# Altium project Noise Toaster.PrjPcb (part 3 of 3)

## Sheet VCF.SchDoc: Voltage Controlled Filter
size Letter; SheetNumber: 8; SheetTotal: 10
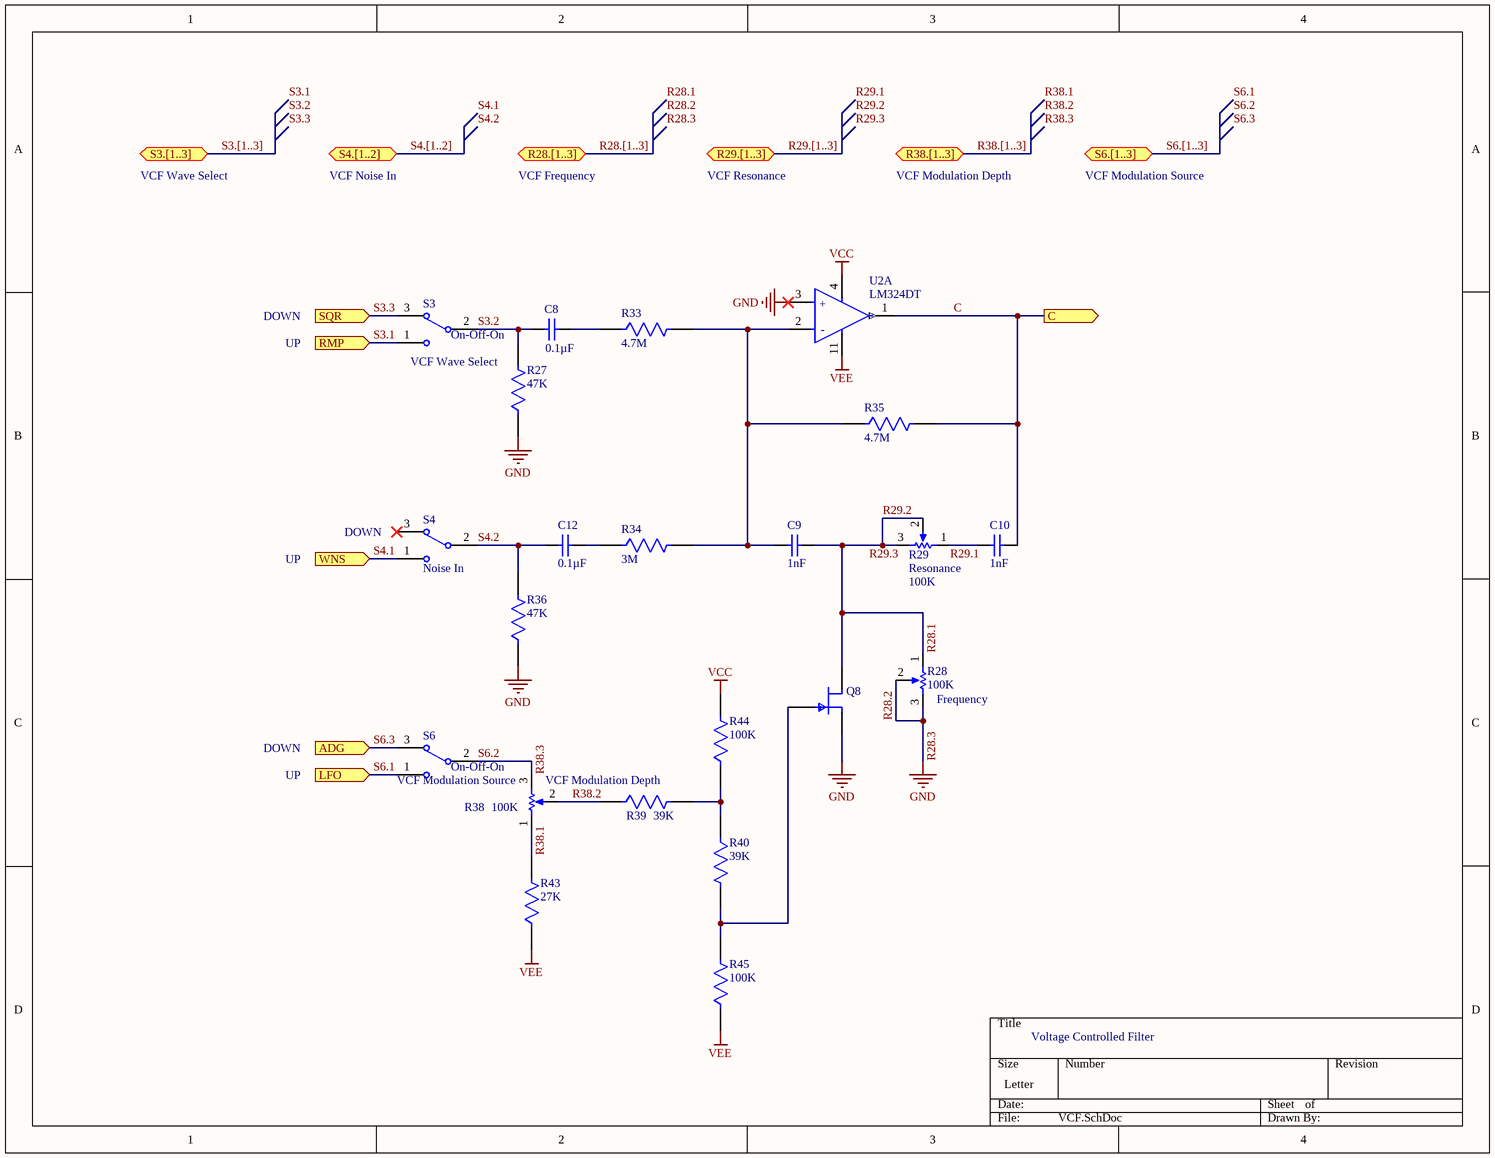
[diagram p7: VCF.SchDoc]

### Parts
C8  Capacitance: 0.1µF  [SAMS-C0603-2_M]  (hidden comment: CL10B104KB8NNNC)
C9  Capacitance: 1nF  [CAPC1608X90X35NL10T15]  (hidden comment: 885012206083‎)
C10  Capacitance: 1nF  [CAPC1608X90X35NL10T15]  (hidden comment: 885012206083‎)
C12  Capacitance: 0.1µF  [SAMS-C0603-2_M]  (hidden comment: CL10B104KB8NNNC)
Q8  MMBFJ113  [FP-318BM-IPC_C]  (value not drawn)
R27  Resistance: 47K  [FP-ESR03-IPC_B]  (hidden comment: ESR03EZPJ473)
R28  Frequency  value 100K  [VR5]  (graphical)
R29  Resonance  value 100K  [VR5]  (graphical)
R33  Resistance: 4.7M  [FP-ESR03-IPC_B]  (hidden comment: ESR03EZPJ475)
R34  Resistance: 3M  [FP-ESR03-IPC_B]  (hidden comment: ESR03EZPJ305)
R35  Resistance: 4.7M  [FP-ESR03-IPC_B]  (hidden comment: ESR03EZPJ475)
R36  Resistance: 47K  [FP-ESR03-IPC_B]  (hidden comment: ESR03EZPJ473)
R38  VCF Modulation Depth  value 100K  [VR5]  (graphical)
R39  Resistance: 39K  [FP-ESR03-IPC_B]  (hidden comment: ESR03EZPJ393)
R40  Resistance: 39K  [FP-ESR03-IPC_B]  (hidden comment: ESR03EZPJ393)
R43  Resistance: 27K  [FP-ESR03-IPC_B]  (hidden comment: ESR03EZPJ273)
R44  Resistance: 100K  [FP-ESR03-IPC_B]  (hidden comment: ESR03EZPJ104)
R45  Resistance: 100K  [FP-ESR03-IPC_B]  (hidden comment: ESR03EZPJ104)
S3  VCF Wave Select  Switch Function: On-Off-On  [HDR1X3]  (graphical)
S4  Noise In  [HDR1X3]
S6  VCF Modulation Source  Switch Function: On-Off-On  [HDR1X3]  (graphical)
U2  LM324DT  [FP-SO-14-MFG]  (part A of 4)

### Ports
ADG (in), C (out), LFO (in), R28.[1..3] (bidir), R29.[1..3] (bidir), R38.[1..3] (bidir), RMP (in), S3.[1..3] (bidir), S4.[1..2] (bidir), S6.[1..3] (bidir), SQR (in), WNS (in)

### Nets
GND: Q8.2(S) R27.1 R28.2(TAP) R28.3(BOT) R36.1 U2.3(Non-Inverting_Input_1)  [also labelled R28.2, R28.3]
VCC: R44.2 U2.4(VCC+)
VEE: R43.1 R45.1 U2.11(VCC-)
C: C10.2 R35.2 U2.1(Output_1) ; port C
R28.1: C9.2 Q8.1(D) R28.1(TOP) R29.2(TAP) R29.3(BOT)  [also labelled R29.2, R29.3]
R29.1: C10.1 R29.1(TOP)
R38.1: R38.1(TOP) R43.2
R38.2: R38.2(TAP) R39.1
R38.3: R38.3(BOT) S6.2  [also labelled S6.2]
S3.1: S3.1 ; port RMP  [project net RMP]
S3.2: C8.1 R27.2 S3.2
S3.3: S3.3 ; port SQR
S4.1: S4.1 ; port WNS
S4.2: C12.1 R36.2 S4.2
S6.1: S6.1 ; port LFO  [project net LFO]
S6.3: S6.3 ; port ADG  [project net ADG]
NetC8_2: C8.2 R33.1
NetC9_1: C9.1 R33.2 R34.2 R35.1 U2.2(Inverting_Input_1)
NetC12_2: C12.2 R34.1
NetQ8_3: Q8.3(G) R40.2 R45.2
NetR39_2: R39.2 R40.1 R44.1

Not connected (* = marked no-connect by the designer): S4 3*

### Buses and harness runs
bus R28.[1..3] = port R28.[1..3]
bus R29.[1..3] = port R29.[1..3]
bus R38.[1..3] = port R38.[1..3]
bus S3.[1..3] = port S3.[1..3]
bus S4.[1..2] = port S4.[1..2]
bus S6.[1..3] = port S6.[1..3]

### Notes on the sheet
- VCF Wave Select
- VCF Noise In
- VCF Frequency
- VCF Resonance
- VCF Modulation Depth
- VCF Modulation Source
- DOWN
- UP
- (near S4) DOWN
- Labels drawn without touching a wire or pin: R28.1, R28.2, R28.3, R29.1, R29.2, R29.3, R38.1, R38.2, R38.3, S3.1, S3.2, S3.3, S4.1, S4.2, S6.1, S6.2, S6.3
- (in symbol CMP-12131-000005-1, part A) +; -

### Library data of the parts
C8 C12 = CMP-2000-05332-1: Multi-layer Ceramic Capacitor, -55 to 125 degC, 2-Pin SMD (0603), RoHS, Tape and Reel; Manufacturer: Samsung Electro-Mechanics; Rated Voltage: 50V; Dielectric: X7R; Tolerance (%): ±10%; Case Size/Dimension: 0603; Datasheet URL: https://datasheet.ciiva.com/29198/456651-da-01-en-vs-kondensator-0605-29198839.pdf; Manufacturer URL: http://www.samsungsem.com/global/index.jsp; Datasheet Version: Nov-10
C9 C10 = CMP-2006-02891-1: Manufacturer: Wurth; Voltage Rating: 50V; Dielectric: X7R; Tolerance: 10%; Part Number: 885012206083‎; Supplier 1: RSComponents; Supplier Part Number 1: 8392938; Manufacturer Part Number: 885012206083; RoHS: Yes; Category: Ceramic Capacitors; Stock 1: 1; Pricing 1: 100=0.02300, 500=0.02000, 2000=0.01800, 4000=0.01600, 8000=0.00900 (USD); Mount: Surface Mount; Case/Package: 0603; Case Code (Metric): 1608; Case Code (Imperial): 0603; Min Operating Temperature: -55°C; Max Operating Temperature: 125°C; Packaging: Cut Tape; Voltage Rating (DC): 50V; Length: 0.063inch; Width: 0.031inch; Thickness: 0.037inch; REACH SVHC: Unknown; RoHS Compliant: Yes; ComponentLink1URL: http://www.farnell.com/datasheets/1958479.pdf?src-supplier=Farnell; ComponentLink1Description: http://www.farnell.com/datasheets/1958479.pdf?src-supplier=Farnell; ComponentLink2URL: http://www.farnell.com/datasheets/1958479.pdf?src-supplier=Element14; ComponentLink2Description: http://www.farnell.com/datasheets/1958479.pdf?src-supplier=Element14; ComponentLink3URL: https://katalog.we-online.de/pbs/datasheet/885012206083.pdf?src-supplier=Digi-Key; ComponentLink3Description: https://katalog.we-online.de/pbs/datasheet/885012206083.pdf?src-supplier=Digi-Key; ComponentLink4URL: http://www.farnell.com/datasheets/1958479.pdf?src-supplier=Newark; ComponentLink4Description: http://www.farnell.com/datasheets/1958479.pdf?src-supplier=Newark
Q8 = CMP-07172-000001-1: JFET N-CH 35V 350MW SOT23; Manufacturer: ON Semiconductor; Number Of N Channels: 1; Gate To Source Voltage: -35V; Drain To Source Resistance: 100Ω; Standoff Height: 0mm; Rthja Max: 357°C/W; Max Junction Temp: +150°C; Gate to Source Voltage (Vgs): -25V; Element Configuration: Single; Input Capacitance: 7pF; Drain to Source Voltage (Vdss): 25V; Continuous Drain Current (ID): 5mA; Current Rating: 10mA; Polarity: N-CHANNEL; Device Class L2: Transistors; Number Of Channels: 1; ComponentLink2Description: Datasheet; Device Class L3: JFETs; Device Class L1: Discrete Semiconductors; Lead Free: Yes; Power Dissipation: 350mW; Category: Trans; Mouser Description: JFET N-Channel Switch; ComponentLink2URL: https://www.onsemi.com/pub/Collateral/MMBFJ113-D.PDF; RoHS: TRUE; Footprint Url: https://www.onsemi.com/pub/Collateral/318BM.PDF; Height: 1.2mm; Package: 318BM; Temperature Range High: +150°C; Manufacturer Part Number: MMBFJ113; Temperature: -55°C to +150°C; Digikey Description: JFET N-CH 35V 350MW SOT23; Temperature Range Low: -55°C; Octopart: https://octopart.com/mmbfj113-on+semiconductor-84330253; Automotive: No; Ipc Land Pattern Name: SOT95P240X120-3; Supplier 1: Digi-Key; Supplier Part Number 1: MMBF5457CT-ND; Stock 1: 13304; Pricing 1: 1=0.50000, 10=0.39000, 25=0.37280, 100=0.23400, 500=0.21670, 1000=0.14736 (USD); Mount: Surface Mount; Case/Package: SOT-23; Number of Pins: 3; Weight: 0.03g; Contact Plating: Tin,Matte; Min Operating Temperature: -55°C; Max Operating Temperature: 150°C; Packaging: Tape and Reel; Package Quantity: 1; Max Power Dissipation: 350mW; Voltage Rating (DC): 25V; Series: MMBF5457; Length: 2.92mm; Width: 1.3mm; Radiation Hardening: No; RoHS Compliant: Yes; REACH SVHC: No SVHC; ComponentLink1URL: https://datasheet.ciiva.com/25625/0900766b810cdc04-25625787.pdf?src-supplier=RSComponents; ComponentLink1Description: https://datasheet.ciiva.com/25625/0900766b810cdc04-25625787.pdf?src-supplier=RSComponents; ComponentLink3URL: https://datasheet.ciiva.com/8120/mmbf5459-8120391.pdf?src-supplier=Avnet; ComponentLink3Description: https://datasheet.ciiva.com/8120/mmbf5459-8120391.pdf?src-supplier=Avnet; ComponentLink4URL: https://datasheet.ciiva.com/26026/mmbf5459-26026568.pdf?src-supplier=Avnet+Europe; ComponentLink4Description: https://datasheet.ciiva.com/26026/mmbf5459-26026568.pdf?src-supplier=Avnet+Europe; ComponentLink5URL: https://datasheet.ciiva.com/960/mmbf5457-960906.pdf?src-supplier=Digi-Key; ComponentLink5Description: https://datasheet.ciiva.com/960/mmbf5457-960906.pdf?src-supplier=Digi-Key; ComponentLink6URL: https://datasheet.ciiva.com/960/mmbf5457-960907.pdf?src-supplier=Digi-Key; ComponentLink6Description: https://datasheet.ciiva.com/960/mmbf5457-960907.pdf?src-supplier=Digi-Key; ComponentLink7URL: https://datasheet.ciiva.com/46445/46943-46445739.pdf?src-supplier=Element14; ComponentLink7Description: https://datasheet.ciiva.com/46445/46943-46445739.pdf?src-supplier=Element14; ComponentLink8URL: https://datasheet.ciiva.com/960/mmbf5457-960908.pdf?src-supplier=Digi-Key; ComponentLink8Description: https://datasheet.ciiva.com/960/mmbf5457-960908.pdf?src-supplier=Digi-Key; ComponentLink9URL: https://datasheet.ciiva.com/3304/mmbf5459-3304349.pdf?src-supplier=Avnet; ComponentLink9Description: https://datasheet.ciiva.com/3304/mmbf5459-3304349.pdf?src-supplier=Avnet
R27 R36 = CMP-08839-028279-1: 47kΩ ±5% 0.25W 0603 Anti-Surge Chip Resistor AEC-Q200; Max Power Dissipation: 250mW; Temperature Coefficient: 200ppm/°C; Series: ESR; Number of Terminations: 2; Min Operating Temperature: -55°C; Features: Automotive AEC-Q200; Width: 0.031inch; Case Code (Imperial): 0603; Case/Package: 0603; Packaging: Tape and Reel; Resistor Type: Thick Film; Length: 0.063inch; Tolerance: 5%; Package Quantity: 1; Max Operating Temperature: 155°C; Height: 0.022inch; Case Code (Metric): 1608; RoHS Compliant: Yes
R28 R29 R38 = RPot: Potentiometer; Sim Note: Enter the Resistance value and the set point into parameter fields.; Set Position: 0.5; Published: 8-Jun-2000; LatestRevisionDate: 17-Jul-2002; LatestRevisionNote: Re-released for DXP Platform.; PackageReference: VR5; Publisher: Altium Limited; PackageDescription: Variable Resistor, Thru-Hole; 3 Leads
R33 R35 = CMP-08839-028926-1: 4.7MΩ ±5% 0.25W 0603 Anti-Surge Chip Resistor AEC-Q200; Temperature Coefficient: 200ppm/°C; Max Power Dissipation: 250mW; Series: ESR; Package Quantity: 5000; Packaging: Cut Tape; Min Operating Temperature: -55°C; RoHS Compliant: Yes; Number of Terminations: 2; Resistor Type: Thick Film; Tolerance: 5%; Length: 0.063inch; Height: 0.022inch; Width: 0.031inch; Case Code (Metric): 1608; Case/Package: 0603; Max Operating Temperature: 155°C; Features: Automotive AEC-Q200; Case Code (Imperial): 0603
R34 = CMP-08839-028673-1: 3MΩ ±5% 0.25W 0603 Anti-Surge Chip Resistor AEC-Q200; Max Power Dissipation: 250mW; Temperature Coefficient: 200ppm/°C; Case Code (Metric): 1608; Resistor Type: Thick Film; Tolerance: 5%; Length: 0.063inch; Case Code (Imperial): 0603; Max Operating Temperature: 155°C; Packaging: Tape and Reel; Package Quantity: 5000; Case/Package: 0603; Series: ESR; Width: 0.031inch; Min Operating Temperature: -55°C; Height: 0.022inch; RoHS Compliant: Yes; Features: Automotive AEC-Q200; Number of Terminations: 2
R39 R40 = CMP-08839-004997-1: 39kΩ ±5% 0.25W 0603 Anti-Surge Chip Resistor AEC-Q200; Max Power Dissipation: 250mW; Temperature Coefficient: 200ppm/°C; Case Code (Imperial): 0603; Min Operating Temperature: -55°C; Features: Automotive AEC-Q200; Length: 0.063inch; Case/Package: 0603; Max Operating Temperature: 155°C; Resistor Type: Thick Film; Package Quantity: 5000; Case Code (Metric): 1608; Number of Terminations: 2; Packaging: Cut Tape; Tolerance: 5%; Width: 0.031inch; Series: ESR; RoHS Compliant: Yes; Height: 0.022inch
R43 = CMP-08839-028661-1: 27kΩ ±5% 0.25W 0603 Anti-Surge Chip Resistor AEC-Q200; Temperature Coefficient: 200ppm/°C; Max Power Dissipation: 250mW; Max Operating Temperature: 155°C; Case Code (Metric): 1608; Case Code (Imperial): 0603; Width: 0.031inch; Packaging: Cut Tape; Series: ESR; Number of Terminations: 2; RoHS Compliant: Yes; Case/Package: 0603; Features: Automotive AEC-Q200; Tolerance: 5%; Length: 0.063inch; Height: 0.022inch; Min Operating Temperature: -55°C; Resistor Type: Thick Film; Package Quantity: 5000
R44 R45 = CMP-08839-029521-1: 100kΩ ±5% 0.25W 0603 Anti-Surge Chip Resistor AEC-Q200; Power Rating: 200mW; Max Power Dissipation: 250mW; Temperature Coefficient: 200ppm/°C; Length: 0.063inch; Case Code (Imperial): 0603; Case/Package: 0603; Resistor Type: Thick Film; Features: Automotive AEC-Q200; Package Quantity: 1; Width: 0.031inch; Packaging: Cut Tape; Min Operating Temperature: -55°C; Series: ESR; RoHS Compliant: Yes; Size Code: 0603; Tolerance: 5%; Height: 0.022inch; Max Operating Temperature: 155°C; Lead Free: Lead Free; Case Code (Metric): 1608; Number of Terminations: 2
S3 S6 = SW-SPDT: Switch Toggle ON OFF ON SPDT Round Lever Solder Lug 5A 250VAC 28VDC Panel Mount with Threads; Manufacturer: E-Switch; Manufacturer Part Number: 100SP3T1B1M1QEH; Actuator Material: Brass,Chrome; Actuator Color: Chrome; Voltage Rating (AC): 120V; Voltage Rating (DC): 28V; Illumination Type: Non-Illuminated,Illuminated; Electrical Life: 40000Cycles; Actuator Type: Standard Round; Contact Resistance: 100mR; Max Voltage Rating (AC): 250V; Actuator Length: 10.41mm; Published: 24-Mar-1999; LatestRevisionDate: 17-Dec-2003; LatestRevisionNote: Schematic revised, PCB Footprint replaced.; DatasheetVersion: 05-Dec-2000; PackageReference: TL36WW15050; Publisher: Altium Limited; PackageDescription: Switch; 4 Leads; ComponentLink1Description: Manufacturer Link; ComponentLink1URL: http://www.apem.com; Supplier 1: Newark; Supplier Part Number 1: 16N0109; RoHS: Yes; Category: Toggle Switches; Stock 1: 100; Pricing 1: 1=3.40000, 10=3.05000, 25=2.88000, 50=2.75000, 100=2.61000, 250=2.50000 (USD); Mount: Panel; Contact Material: Copper Alloy,Silver; Contact Plating: Silver; Housing Material: Stainless Steel; Min Operating Temperature: -30°C; Max Operating Temperature: 85°C; Throw Configuration: SPDT; Package Quantity: 1; Packaging: Bulk; Termination: Solder; Orientation: Straight; Series: 100; Current Rating: 5A; Max Voltage Rating (DC): 28V; Lead Free: Lead Free; RoHS Compliant: Yes; ComponentLink2URL: https://datasheet.ciiva.com/2905/1012730000-jpg-2905501.pdf?src-supplier=Digi-Key; ComponentLink2Description: https://datasheet.ciiva.com/2905/1012730000-jpg-2905501.pdf?src-supplier=Digi-Key; ComponentLink3URL: https://datasheet.ciiva.com/24480/st113001-24480688.pdf?src-supplier=Onlinecomponents.com; ComponentLink3Description: https://datasheet.ciiva.com/24480/st113001-24480688.pdf?src-supplier=Onlinecomponents.com; ComponentLink4URL: https://datasheet.ciiva.com/16338/100-16338027.pdf?src-supplier=Future+Electronics; ComponentLink4Description: https://datasheet.ciiva.com/16338/100-16338027.pdf?src-supplier=Future+Electronics
S4 = SW-SPDT: Switch Toggle ON None ON SPDT Round Lever Solder Lug 5A 250VAC 28VDC Panel Mount with Threads; Manufacturer: E-Switch; Manufacturer Part Number: 100SP1T1B1M1QEH; Actuator Material: Brass,Chrome; Actuator Color: Chrome; Voltage Rating (AC): 120V; Voltage Rating (DC): 28V; Max Voltage Rating (AC): 250V; Illumination Type: Illuminated,Non-Illuminated; Switch Function: On-On; Actuator Type: Standard Round; Contact Resistance: 100mR; Electrical Life: 40000Cycles; Actuator Length: 10.41mm; Supplier 1: Newark; Supplier Part Number 1: 15N9971; RoHS: Yes; Category: Toggle Switches; Stock 1: 978; Pricing 1: 1=3.08000, 10=2.76000, 25=2.61000, 50=2.49000, 100=2.37000 (USD); Mount: Panel; Contact Material: Copper Alloy,Silver; Contact Plating: Silver; Housing Material: Stainless Steel; Min Operating Temperature: -30°C; Max Operating Temperature: 85°C; Throw Configuration: SPDT; Current Rating: 5A; Package Quantity: 1; Packaging: Bulk; Max Voltage Rating (DC): 28V; Termination: Solder; Orientation: Straight; Series: 100; REACH SVHC: No SVHC; Lead Free: Lead Free; RoHS Compliant: Yes; ComponentLink1URL: https://datasheet.ciiva.com/2904/st110007c-2904798.pdf?src-supplier=Digi-Key; ComponentLink1Description: https://datasheet.ciiva.com/2904/st110007c-2904798.pdf?src-supplier=Digi-Key; ComponentLink2URL: https://datasheet.ciiva.com/16154/xt0157p-16154561.pdf?src-supplier=Onlinecomponents.com; ComponentLink2Description: https://datasheet.ciiva.com/16154/xt0157p-16154561.pdf?src-supplier=Onlinecomponents.com; ComponentLink3URL: https://datasheet.ciiva.com/16347/100-16347391.pdf?src-supplier=Future+Electronics; ComponentLink3Description: https://datasheet.ciiva.com/16347/100-16347391.pdf?src-supplier=Future+Electronics
U2 = CMP-12131-000005-1: IC OPAMP GP 4 CIRCUIT 14SO; Manufacturer: STMicroelectronics; Voltage Gain: 100dB; Standoff Height: 0.1mm; Bandwidth: 1.3MHz; Max Junction Temp: +150°C; Min Supply Voltage: 3V; Max Dual Supply Voltage: 15V; Min Dual Supply Voltage: 1.5V; Number Of Channels: 4; Nominal Supply Current: 0.7-1.5mA; Output Current Per Channel: 20-50mA; Max Supply Voltage: 30V; Input Offset Voltage: 2mV; Input Bias Current: 0.02uA; Device Class L1: Integrated Circuits (ICs); Device Class L3: Amplifiers - Op Amps; Temperature Range Low: 0°C; Package: SO-14; Temperature Range High: +70°C; Digikey Description: IC OPAMP GP 4 CIRCUIT 14SO; Device Class L2: Linear ICs; Footprint Url: https://www.st.com/content/ccc/resource/technical/document/datasheet/group3/10/8a/e6/12/f8/e8/49/ce/DM00366438/files/DM00366438.pdf/jcr:content/translations/en.DM00366438.pdf; Octopart: https://octopart.com/lm324dt-stmicroelectronics-39579146; ComponentLink2URL: https://www.st.com/content/ccc/resource/technical/document/datasheet/bd/fc/46/43/26/8f/40/7f/CD00001046.pdf/files/CD00001046.pdf/jcr:content/translations/en.CD00001046.pdf; ComponentLink2Description: Datasheet; Lead Free: Yes; Temperature: 0°C to +70°C; RoHS: TRUE; Gain Bandwidth: 1.3MHz; Manufacturer Part Number: LM324DT; Automotive: No; Category: IC; Height: 1.75mm; Mouser Description: LM324 Series 32 V 1.3 MHz Low Power Quad Operational Amplifier - SOIC-14

## Sheet VCA.SchDoc: Voltage Controlled Amplifier
size Letter; SheetNumber: 7; SheetTotal: 10
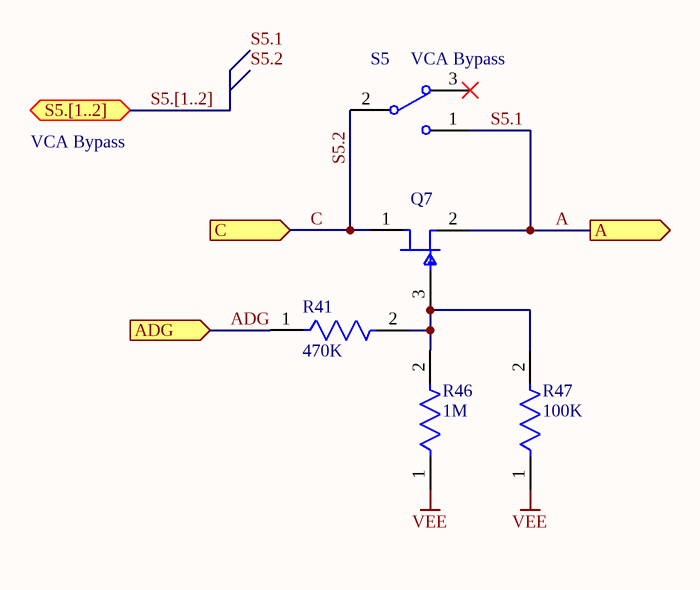
[diagram p8: VCA.SchDoc]

### Parts
Q7  MMBFJ113  [FP-318BM-IPC_C]  (value not drawn)
R41  Resistance: 470K  [FP-ESR03-IPC_B]  (hidden comment: ESR03EZPJ474)
R46  Resistance: 1M  [FP-ESR03-IPC_B]  (hidden comment: ESR03EZPJ105)
R47  Resistance: 100K  [FP-ESR03-IPC_B]  (hidden comment: ESR03EZPJ104)
S5  VCA Bypass  [HDR1X3]

### Ports
A (out), ADG (in), C (in), S5.[1..2] (bidir)

### Nets
VEE: R46.1 R47.1
A: Q7.2(S) S5.1 ; port A  [also labelled S5.1]
ADG: R41.1 ; port ADG
C: Q7.1(D) S5.2 ; port C  [also labelled S5.2]
NetQ7_3: Q7.3(G) R41.2 R46.2 R47.2

Not connected (* = marked no-connect by the designer): S5 3*

### Buses and harness runs
bus S5.[1..2] = port S5.[1..2]

### Notes on the sheet
- VCA Bypass
- Labels drawn without touching a wire or pin: S5.1, S5.2

### Library data of the parts
Q7 = CMP-07172-000001-1: as Q8 on sheet VCF; Device Class L2: Transistors; Number Of Channels: 1; ComponentLink2Description: Datasheet; Device Class L3: JFETs; Device Class L1: Discrete Semiconductors; Lead Free: Yes; Power Dissipation: 350mW; Category: Trans; Mouser Description: JFET N-Channel Switch; ComponentLink2URL: https://www.onsemi.com/pub/Collateral/MMBFJ113-D.PDF; RoHS: TRUE; Footprint Url: https://www.onsemi.com/pub/Collateral/318BM.PDF; Height: 1.2mm; Package: 318BM; Temperature Range High: +150°C; Manufacturer Part Number: MMBFJ113; Temperature: -55°C to +150°C; Digikey Description: JFET N-CH 35V 350MW SOT23; Temperature Range Low: -55°C; Octopart: https://octopart.com/mmbfj113-on+semiconductor-84330253; Automotive: No; Ipc Land Pattern Name: SOT95P240X120-3; Supplier 1: Digi-Key; Supplier Part Number 1: MMBF5457CT-ND; Stock 1: 13304; Pricing 1: 1=0.50000, 10=0.39000, 25=0.37280, 100=0.23400, 500=0.21670, 1000=0.14736 (USD); Mount: Surface Mount; Case/Package: SOT-23; Number of Pins: 3; Weight: 0.03g; Contact Plating: Tin,Matte; Min Operating Temperature: -55°C; Max Operating Temperature: 150°C; Packaging: Tape and Reel; Package Quantity: 1; Max Power Dissipation: 350mW; Voltage Rating (DC): 25V; Series: MMBF5457; Length: 2.92mm; Width: 1.3mm; Radiation Hardening: No; RoHS Compliant: Yes; REACH SVHC: No SVHC; ComponentLink1URL: https://datasheet.ciiva.com/25625/0900766b810cdc04-25625787.pdf?src-supplier=RSComponents; ComponentLink1Description: https://datasheet.ciiva.com/25625/0900766b810cdc04-25625787.pdf?src-supplier=RSComponents; ComponentLink3URL: https://datasheet.ciiva.com/8120/mmbf5459-8120391.pdf?src-supplier=Avnet; ComponentLink3Description: https://datasheet.ciiva.com/8120/mmbf5459-8120391.pdf?src-supplier=Avnet; ComponentLink4URL: https://datasheet.ciiva.com/26026/mmbf5459-26026568.pdf?src-supplier=Avnet+Europe; ComponentLink4Description: https://datasheet.ciiva.com/26026/mmbf5459-26026568.pdf?src-supplier=Avnet+Europe; ComponentLink5URL: https://datasheet.ciiva.com/960/mmbf5457-960906.pdf?src-supplier=Digi-Key; ComponentLink5Description: https://datasheet.ciiva.com/960/mmbf5457-960906.pdf?src-supplier=Digi-Key; ComponentLink6URL: https://datasheet.ciiva.com/960/mmbf5457-960907.pdf?src-supplier=Digi-Key; ComponentLink6Description: https://datasheet.ciiva.com/960/mmbf5457-960907.pdf?src-supplier=Digi-Key; ComponentLink7URL: https://datasheet.ciiva.com/46445/46943-46445739.pdf?src-supplier=Element14; ComponentLink7Description: https://datasheet.ciiva.com/46445/46943-46445739.pdf?src-supplier=Element14; ComponentLink8URL: https://datasheet.ciiva.com/960/mmbf5457-960908.pdf?src-supplier=Digi-Key; ComponentLink8Description: https://datasheet.ciiva.com/960/mmbf5457-960908.pdf?src-supplier=Digi-Key; ComponentLink9URL: https://datasheet.ciiva.com/3304/mmbf5459-3304349.pdf?src-supplier=Avnet; ComponentLink9Description: https://datasheet.ciiva.com/3304/mmbf5459-3304349.pdf?src-supplier=Avnet
R41 = CMP-08839-028761-1: 470kΩ ±5% 0.25W 0603 Anti-Surge Chip Resistor AEC-Q200; Temperature Coefficient: 200ppm/°C; Max Power Dissipation: 250mW; RoHS Compliant: Yes; Packaging: Cut Tape; Max Operating Temperature: 155°C; Package Quantity: 5000; Resistor Type: Thick Film; Min Operating Temperature: -55°C; Number of Terminations: 2; Features: Automotive AEC-Q200; Tolerance: 5%; Width: 0.031inch; Case Code (Metric): 1608; Length: 0.063inch; Case/Package: 0603; Height: 0.022inch; Case Code (Imperial): 0603; Series: ESR
R46 = CMP-08839-029147-1: 1MΩ ±5% 0.25W 0603 Anti-Surge Chip Resistor AEC-Q200; Max Power Dissipation: 250mW; Temperature Coefficient: 200ppm/°C; Width: 0.031inch; Package Quantity: 1; Case/Package: 0603; Features: Automotive AEC-Q200; Packaging: Cut Tape; Case Code (Metric): 1608; Number of Terminations: 2; Series: ESR; Max Operating Temperature: 155°C; Resistor Type: Thick Film; RoHS Compliant: Yes; Min Operating Temperature: -55°C; Height: 0.022inch; Length: 0.063inch; Tolerance: 5%; Case Code (Imperial): 0603
R47 = CMP-08839-029521-1: as R44 on sheet VCF; Length: 0.063inch; Case Code (Imperial): 0603; Case/Package: 0603; Resistor Type: Thick Film; Features: Automotive AEC-Q200; Package Quantity: 1; Width: 0.031inch; Packaging: Cut Tape; Min Operating Temperature: -55°C; Series: ESR; RoHS Compliant: Yes; Size Code: 0603; Tolerance: 5%; Height: 0.022inch; Max Operating Temperature: 155°C; Lead Free: Lead Free; Case Code (Metric): 1608; Number of Terminations: 2
S5 = SW-SPDT: as S4 on sheet VCF; Supplier 1: Newark; Supplier Part Number 1: 15N9971; RoHS: Yes; Category: Toggle Switches; Stock 1: 978; Pricing 1: 1=3.08000, 10=2.76000, 25=2.61000, 50=2.49000, 100=2.37000 (USD); Mount: Panel; Contact Material: Copper Alloy,Silver; Contact Plating: Silver; Housing Material: Stainless Steel; Min Operating Temperature: -30°C; Max Operating Temperature: 85°C; Throw Configuration: SPDT; Current Rating: 5A; Package Quantity: 1; Packaging: Bulk; Max Voltage Rating (DC): 28V; Termination: Solder; Orientation: Straight; Series: 100; REACH SVHC: No SVHC; Lead Free: Lead Free; RoHS Compliant: Yes; ComponentLink1URL: https://datasheet.ciiva.com/2904/st110007c-2904798.pdf?src-supplier=Digi-Key; ComponentLink1Description: https://datasheet.ciiva.com/2904/st110007c-2904798.pdf?src-supplier=Digi-Key; ComponentLink2URL: https://datasheet.ciiva.com/16154/xt0157p-16154561.pdf?src-supplier=Onlinecomponents.com; ComponentLink2Description: https://datasheet.ciiva.com/16154/xt0157p-16154561.pdf?src-supplier=Onlinecomponents.com; ComponentLink3URL: https://datasheet.ciiva.com/16347/100-16347391.pdf?src-supplier=Future+Electronics; ComponentLink3Description: https://datasheet.ciiva.com/16347/100-16347391.pdf?src-supplier=Future+Electronics

## Sheet Front Panel Header.SchDoc: Front Panel Connector
size A4; SheetNumber: 2; SheetTotal: 10
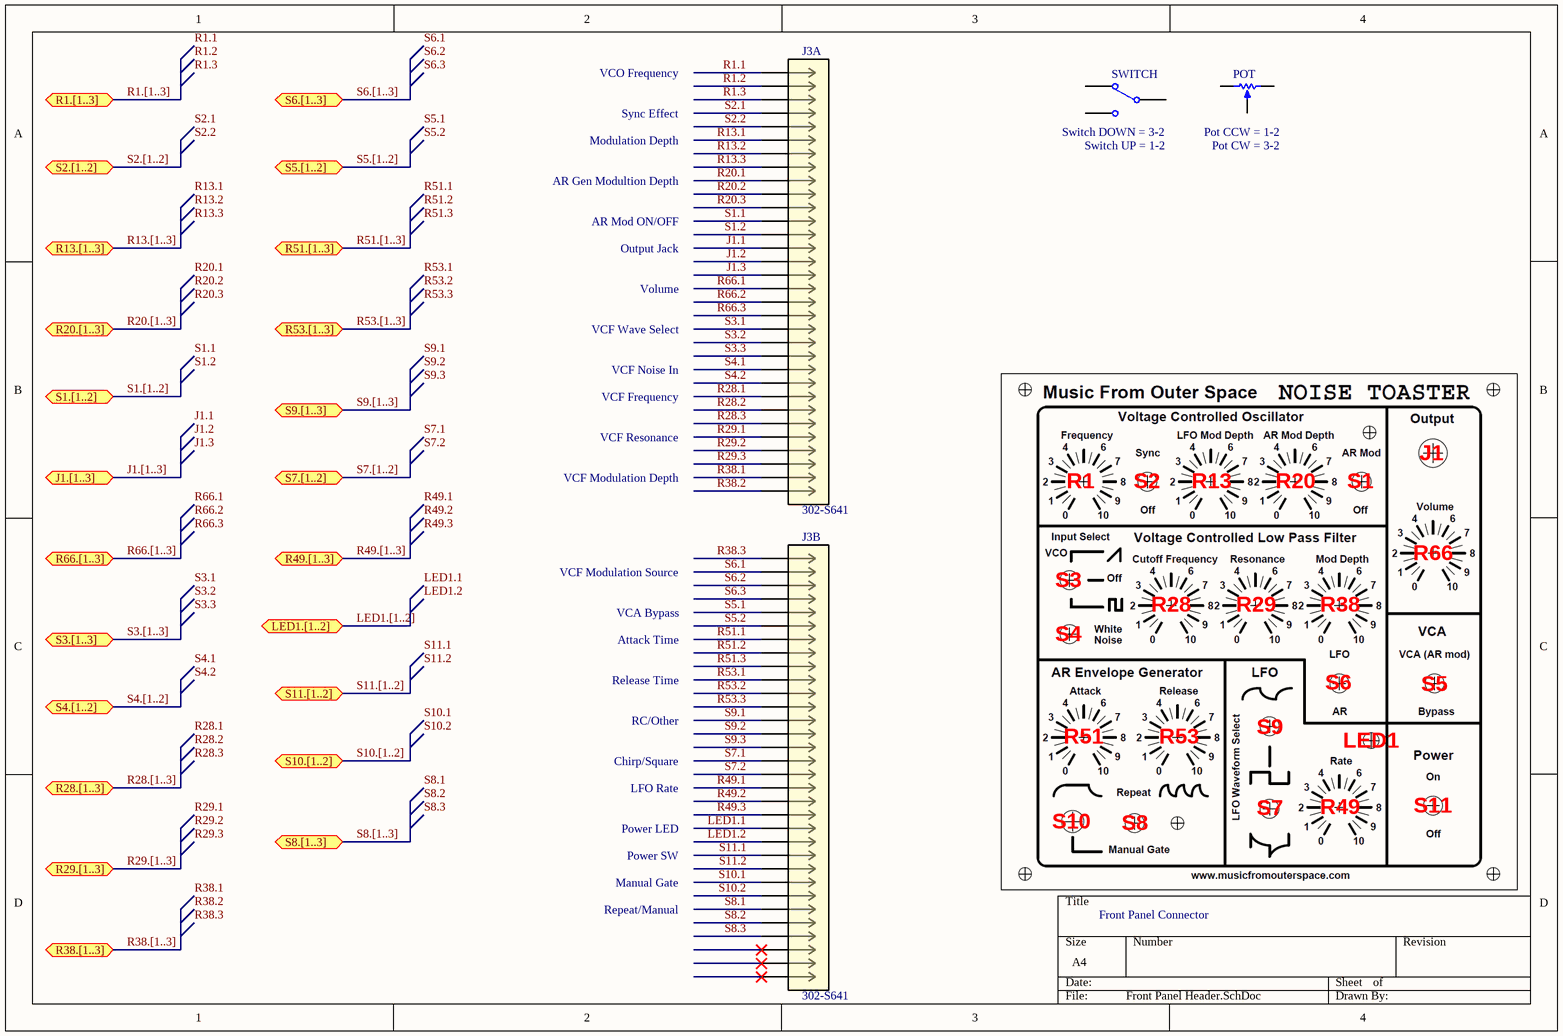
[diagram p9: Front Panel Header.SchDoc]

### Parts
J3  302-S641  [CONN_302-S641_OST]  (parts A,B of 2)
POT  (no value)  [VR5]  (graphical)
SWITCH  (no value)  [HDR1X3]  (graphical)

### Ports
J1.[1..3] (bidir), LED1.[1..2] (bidir), R1.[1..3] (bidir), R13.[1..3] (bidir), R20.[1..3] (bidir), R28.[1..3] (bidir), R29.[1..3] (bidir), R38.[1..3] (bidir), R49.[1..3] (bidir), R51.[1..3] (bidir), R53.[1..3] (bidir), R66.[1..3] (bidir), S1.[1..2] (bidir), S2.[1..2] (bidir), S3.[1..3] (bidir), S4.[1..2] (bidir), S5.[1..2] (bidir), S6.[1..3] (bidir), S7.[1..2] (bidir), S8.[1..3] (bidir), S9.[1..3] (bidir), S10.[1..2] (bidir), S11.[1..2] (bidir)

### Nets
J1.3: J3.9 J3.16 J3.26 J3.27  [also labelled R20.1, R28.2, R28.3]  [project net GND]
R1.1: J3.1 J3.6 J3.17  [also labelled R13.1, R66.1]  [project net VEE]
R1.3: J3.3 J3.55 J3.57  [also labelled S10.1, S11.1]  [project net VCC]
J1.1: J3.14
J1.2: J3.15
LED1.1: J3.53
LED1.2: J3.5 J3.49 J3.50 J3.51 J3.54  [also labelled R49.1, R49.2, S2.2, S7.2]  [project net B]
R1.2: J3.2
R13.2: J3.7
R13.3: J3.8 J3.34 J3.46  [also labelled S6.1, S9.2]  [project net LFO]
R20.2: J3.10
R20.3: J3.11 J3.12  [also labelled S1.1]
R28.1: J3.25 J3.29 J3.30  [also labelled R29.2, R29.3]
R29.1: J3.28
R38.1: J3.31
R38.2: J3.32
R38.3: J3.33 J3.35  [also labelled S6.2]
R49.3: J3.52
R51.1: J3.39 J3.40 J3.42 J3.43  [also labelled R51.2, R53.1, R53.2]
R51.3: J3.41
R53.3: J3.44
R66.2: J3.18
R66.3: J3.19 J3.37  [also labelled S5.1]  [project net A]
S1.2: J3.13 J3.36  [also labelled S6.3]  [project net ADG]
S2.1: J3.4
S3.1: J3.20  [project net RMP]
S3.2: J3.21
S3.3: J3.22
S4.1: J3.23
S4.2: J3.24
S5.2: J3.38  [project net C]
S7.1: J3.45 J3.48  [also labelled S9.1]
S8.1: J3.59
S8.2: J3.60
S8.3: J3.61
S9.3: J3.47
S10.2: J3.58
S11.2: J3.56

Not connected (* = marked no-connect by the designer): J3 62* 63* 64*; POT 1(TOP) 2(TAP) 3(BOT); SWITCH 1 2 3

### Buses and harness runs
bus J1.[1..3] = port J1.[1..3]
bus LED1.[1..2] = port LED1.[1..2]
bus R1.[1..3] = port R1.[1..3]
bus R13.[1..3] = port R13.[1..3]
bus R20.[1..3] = port R20.[1..3]
bus R28.[1..3] = port R28.[1..3]
bus R29.[1..3] = port R29.[1..3]
bus R38.[1..3] = port R38.[1..3]
bus R49.[1..3] = port R49.[1..3]
bus R51.[1..3] = port R51.[1..3]
bus R53.[1..3] = port R53.[1..3]
bus R66.[1..3] = port R66.[1..3]
bus S1.[1..2] = port S1.[1..2]
bus S2.[1..2] = port S2.[1..2]
bus S3.[1..3] = port S3.[1..3]
bus S4.[1..2] = port S4.[1..2]
bus S5.[1..2] = port S5.[1..2]
bus S6.[1..3] = port S6.[1..3]
bus S7.[1..2] = port S7.[1..2]
bus S8.[1..3] = port S8.[1..3]
bus S9.[1..3] = port S9.[1..3]
bus S10.[1..2] = port S10.[1..2]
bus S11.[1..2] = port S11.[1..2]

### Notes on the sheet
- VCO Frequency
- Sync Effect
- Modulation Depth
- AR Gen Modultion Depth
- (near SWITCH) Switch DOWN = 3-2
- (near SWITCH) Switch UP = 1-2
- (near POT) Pot CCW = 1-2
- (near POT) Pot CW = 3-2
- Output Jack
- AR Mod ON/OFF
- Volume
- VCF Wave Select
- VCF Noise In
- VCF Resonance
- VCF Frequency
- J1
- VCF Modulation Depth
- R1
- S2
- R13
- R20
- S1
- VCF Modulation Source
- S3
- R66
- Attack Time
- VCA Bypass
- S4
- R28
- R29
- R38
- Release Time
- RC/Other
- S6
- S5
- LFO Rate
- Chirp/Square
- R51
- R53
- S9
- LED1
- Power LED
- Power SW
- S10
- S8
- S7
- R49
- S11
- Manual Gate
- Repeat/Manual
- Labels drawn without touching a wire or pin: J1.1, J1.2, J1.3, LED1.1, LED1.2, R1.1, R1.2, R1.3, R13.1, R13.2, R13.3, R20.1, R20.2, R20.3, R28.1, R28.2, R28.3, R29.1, R29.2, R29.3, R38.1, R38.2, R38.3, R49.1, R49.2, R49.3, R51.1, R51.2, R51.3, R53.1, R53.2, R53.3, R66.1, R66.2, R66.3, S1.1, S1.2, S2.1, S2.2, S3.1, S3.2, S3.3, S4.1, S4.2, S5.1, S5.2, S6.1, S6.2, S6.3, S7.1, S7.2, S8.1, S8.2, S8.3, S9.1, S9.2, S9.3, S10.1, S10.2, S11.1, S11.2

### Library data of the parts
J3 = 302-S641: Conn Shrouded Header HDR 64 POS 2.54mm Solder ST Thru-Hole; Manufacturer_Name: On Shore Technology; Voltage Rating: 250V; Connector Type: Male Pin; Contact Resistance: 20mΩ; Number of Contacts: 64; Current Rating: 3A; Insulation Resistance: 1GΩ; REACH SVHC: Yes; Contact Material: Brass; Pitch: 2.54mm; RoHS: Compliant; Number of Rows: 2; Termination: Solder; Max Operating Temperature: 105°C; Height: 9.15mm; Min Operating Temperature: -40°C; Number of Positions: 64; Color: Black; Contact Gender: Male; Row Spacing: 2.54mm; Contact Plating: Gold; Copyright: Copyright (C) 2026 Ultra Librarian. All rights reserved.; Manufacturer_Part_Number: 302-S641; RefDes: RefDes; Type: Type; Supplier 1: DigiKey; Manufacturer: On Shore Technology; Manufacturer Part Number: 302-S641; Category: Card Edge Connectors; Stock 1: 292; Pricing 1: 1=1, 60=0.74883, 120=0.713, 540=0.64111, 1020=0.61296, 5040=0.54763, 10020=0.52174 (USD); Lifecycle Status: Production; Mounting Technology: Through Hole; Pins: 64; Terminal Pitch: 2.54mm; ComponentLink1URL: https://datasheet.octopart.com:443/302-S641-On-Shore-Technology-datasheet-138897390.pdf?src-supplier=IHS; ComponentLink1Description: https://datasheet.octopart.com:443/302-S641-On-Shore-Technology-datasheet-138897390.pdf?src-supplier=IHS; Supplier Part Number 1: ED10532-ND
POT = RPot: as R28 on sheet VCF; Published: 8-Jun-2000; LatestRevisionDate: 17-Jul-2002; LatestRevisionNote: Re-released for DXP Platform.; PackageReference: VR5; Publisher: Altium Limited; PackageDescription: Variable Resistor, Thru-Hole; 3 Leads
SWITCH = SW-SPDT: Switch Toggle ON OFF ON SPDT Round Lever Solder Lug 5A 250VAC 28VDC Panel Mount with Threads; Manufacturer: E-Switch; Manufacturer Part Number: 100SP3T1B1M1QEH; Actuator Material: Brass,Chrome; Actuator Color: Chrome; Voltage Rating (AC): 120V; Voltage Rating (DC): 28V; Illumination Type: Non-Illuminated,Illuminated; Electrical Life: 40000Cycles; Switch Function: On-Off-On; Actuator Type: Standard Round; Contact Resistance: 100mR; Max Voltage Rating (AC): 250V; Actuator Length: 10.41mm; Published: 24-Mar-1999; LatestRevisionDate: 17-Dec-2003; LatestRevisionNote: Schematic revised, PCB Footprint replaced.; DatasheetVersion: 05-Dec-2000; PackageReference: TL36WW15050; Publisher: Altium Limited; PackageDescription: Switch; 4 Leads; ComponentLink1Description: Manufacturer Link; ComponentLink1URL: http://www.apem.com; Supplier 1: Newark; Supplier Part Number 1: 16N0109; RoHS: Yes; Category: Toggle Switches; Stock 1: 100; Pricing 1: 1=3.40000, 10=3.05000, 25=2.88000, 50=2.75000, 100=2.61000, 250=2.50000 (USD); Mount: Panel; Contact Material: Copper Alloy,Silver; Contact Plating: Silver; Housing Material: Stainless Steel; Min Operating Temperature: -30°C; Max Operating Temperature: 85°C; Throw Configuration: SPDT; Package Quantity: 1; Packaging: Bulk; Termination: Solder; Orientation: Straight; Series: 100; Current Rating: 5A; Max Voltage Rating (DC): 28V; Lead Free: Lead Free; RoHS Compliant: Yes; ComponentLink2URL: https://datasheet.ciiva.com/2905/1012730000-jpg-2905501.pdf?src-supplier=Digi-Key; ComponentLink2Description: https://datasheet.ciiva.com/2905/1012730000-jpg-2905501.pdf?src-supplier=Digi-Key; ComponentLink3URL: https://datasheet.ciiva.com/24480/st113001-24480688.pdf?src-supplier=Onlinecomponents.com; ComponentLink3Description: https://datasheet.ciiva.com/24480/st113001-24480688.pdf?src-supplier=Onlinecomponents.com; ComponentLink4URL: https://datasheet.ciiva.com/16338/100-16338027.pdf?src-supplier=Future+Electronics; ComponentLink4Description: https://datasheet.ciiva.com/16338/100-16338027.pdf?src-supplier=Future+Electronics

## Nets that join several sheets
GND: Power Supply (5 pins), Audio Amplifier (J1.3), VCO (R20.1 R32.1), VCF (6 pins), Front Panel Header (J3.9 J3.16 J3.26 J3.27)
VCC: Power Supply (C13.2 C23.2 R37.2 S11.1), White Noise (R8.1 R9.2 R15.1), LFO (R55.2 R70.2), ADG (Q9.1 R63.2 S10.1), Audio Amplifier (C20.2 U3.6), VCO (7 pins), VCF (R44.2 U2.4), Front Panel Header (J3.3 J3.55 J3.57)
VEE: Power Supply (5 pins), White Noise (Q2.2 Q5.1 Q6.2), LFO (C16.1 C19.1 C26.1 R59.2), ADG (5 pins), Audio Amplifier (8 pins), VCO (9 pins), VCF (R43.1 R45.1 U2.11), VCA (R46.1 R47.1), Front Panel Header (J3.1 J3.6 J3.17)
A: Audio Amplifier (R66.3), VCA (Q7.2 S5.1), Front Panel Header (J3.19 J3.37)
ADG: ADG (Q9.2 R54.2 U2.13), VCO (S1.2), VCF (S6.3), VCA (R41.1), Front Panel Header (J3.13 J3.36)
B: LFO (8 pins), VCO (S2.2), Front Panel Header (5 pins)
C: VCF (C10.2 R35.2 U2.1), VCA (Q7.1 S5.2), Front Panel Header (J3.38)
J1.1: Audio Amplifier (C21.1 J1.1), Front Panel Header (J3.14)
J1.2: Audio Amplifier (J1.2 R67.2), Front Panel Header (J3.15)
LED1.1: LFO (LED1.1 R65.1), Front Panel Header (J3.53)
LFO: LFO (S9.2), VCO (R13.3), VCF (S6.1), Front Panel Header (J3.8 J3.34 J3.46)
R1.2: VCO (R1.2 R2.1), Front Panel Header (J3.2)
R13.2: VCO (R13.2 R14.1), Front Panel Header (J3.7)
R20.2: VCO (R20.2 R21.1), Front Panel Header (J3.10)
R20.3: VCO (R20.3 S1.1), Front Panel Header (J3.11 J3.12)
R28.1: VCF (5 pins), Front Panel Header (J3.25 J3.29 J3.30)
R29.1: VCF (C10.1 R29.1), Front Panel Header (J3.28)
R38.1: VCF (R38.1 R43.2), Front Panel Header (J3.31)
R38.2: VCF (R38.2 R39.1), Front Panel Header (J3.32)
R38.3: VCF (R38.3 S6.2), Front Panel Header (J3.33 J3.35)
R49.3: LFO (R48.1 R49.3), Front Panel Header (J3.52)
R51.1: ADG (5 pins), Front Panel Header (J3.39 J3.40 J3.42 J3.43)
R51.3: ADG (D2.1 R51.3), Front Panel Header (J3.41)
R53.3: ADG (D3.2 R53.3), Front Panel Header (J3.44)
R66.2: Audio Amplifier (C21.2 R66.2), Front Panel Header (J3.18)
RMP: VCO (6 pins), VCF (S3.1), Front Panel Header (J3.20)
S2.1: VCO (C6.1 R24.2 S2.1), Front Panel Header (J3.4)
S3.2: VCF (C8.1 R27.2 S3.2), Front Panel Header (J3.21)
S3.3: VCO (R31.1 R32.2), VCF (S3.3), Front Panel Header (J3.22)
S4.1: White Noise (Q6.3 R15.2 R19.1), VCF (S4.1), Front Panel Header (J3.23)
S4.2: VCF (C12.1 R36.2 S4.2), Front Panel Header (J3.24)
S7.1: LFO (C17.1 S7.1 S9.1), Front Panel Header (J3.45 J3.48)
S8.1: ADG (Q10.2 R57.2 S8.1), Front Panel Header (J3.59)
S8.2: ADG (D2.2 D3.1 S8.2), Front Panel Header (J3.60)
S8.3: ADG (R58.2 S8.3 U2.14), Front Panel Header (J3.61)
S9.3: LFO (C19.2 R56.2 S9.3), Front Panel Header (J3.47)
S10.2: ADG (R57.1 R61.2 R62.1 S10.2), Front Panel Header (J3.58)
S11.2: Power Supply (B1.1 S11.2), Front Panel Header (J3.56)